# EasyEDA Pro project ProPrj_飞行器设计之5.8Ghz图传_2025-12-20.epro, board PCB1_1
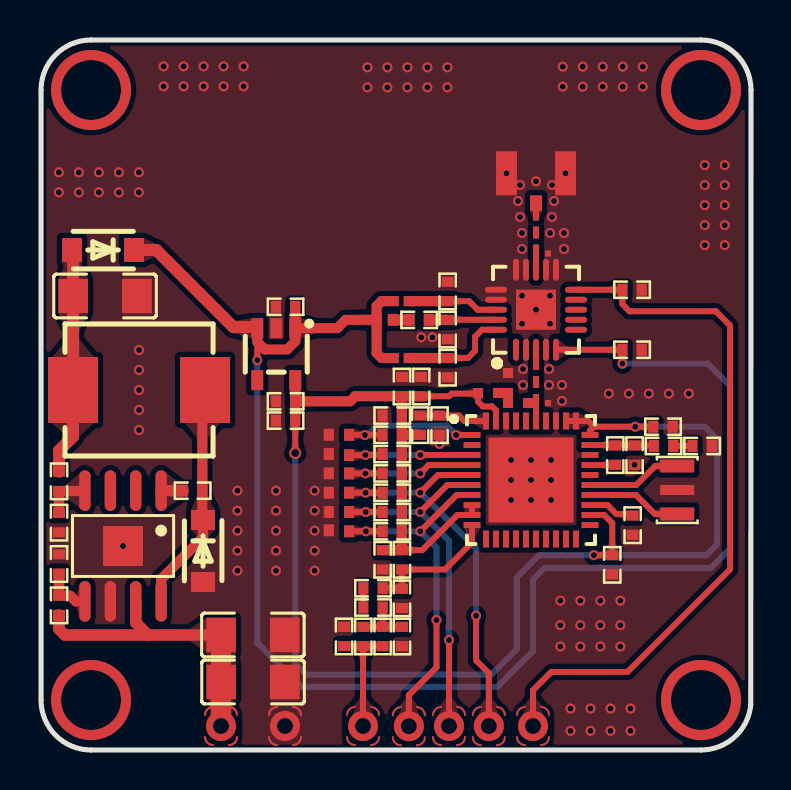
[diagram p13: board, top side]
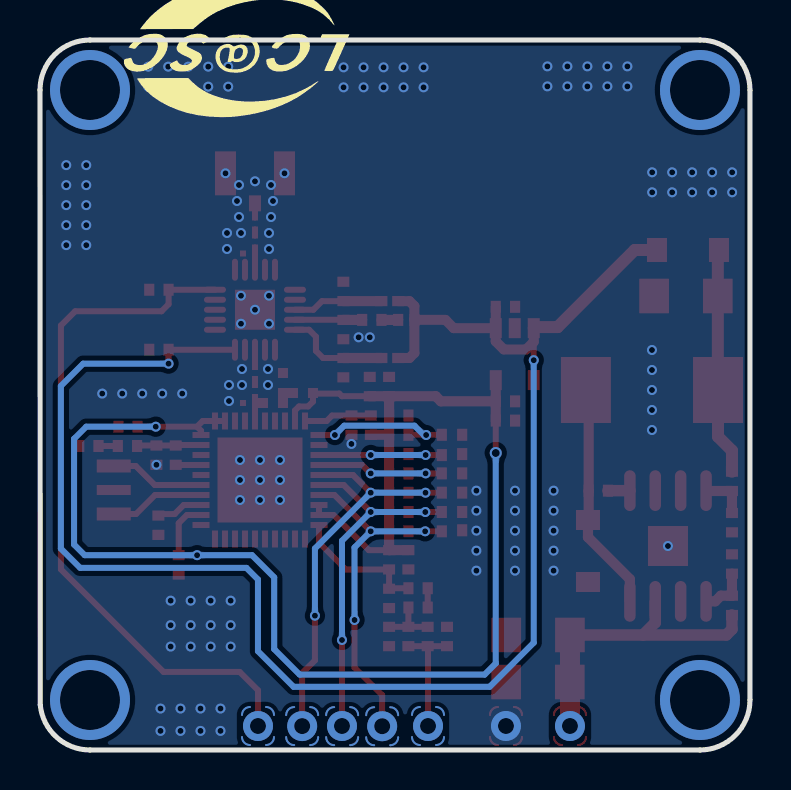
[diagram p14: board, bottom side, seen from below]

Outline 35.5 x 35.5 mm; copper layers: Top Layer, Inner1, Inner2, Bottom Layer. Coordinates in mm from the lower left corner of the outline.
Outline path: 0,33 arc(0.73,34.77) 2.5,35.5 33,35.5 arc(34.77,34.77) 35.5,33 35.49,2.25 arc(34.68,0.65) 33,0 2.5,0 arc(0.73,0.73) 0,2.5 0,33
Stack: Top Layer 0.035mm / Dielectric1 0.48mm PP er 4.5 / Inner1 0.035mm / Dielectric2 0.48mm FR4 er 4.5 / Inner2 0.035mm / Dielectric3 0.48mm PP er 4.5 / Bottom Layer 0.035mm

## Design rules (mm)
spacing safeClearance (default): track to track 0.152, other pairs 0.152 to 0.3
spacing Plane_innerPlane: track to track 0.152, other pairs 0.152 to 0.3
spacing Copper_copperRegion: track to track 0.152, other pairs 0.152 to 0.3
track width trackWidth (default): min 0.127, default 0.254, max 2.54
differential pair differentialPair (default): width min 0.127, default 0.254, max 2.54; gap min 0.152, default 0.152
pour e422 uses Copper_copperRegion
pour e430 uses Copper_copperRegion
pour e432 uses Copper_copperRegion
pour e435 uses Copper_copperRegion

## Placement (name value [footprint] x y rotation side)
C1  2.2uF  [C0402]  20.33 21.02 270 top
C2  2.2uF  [C0402]  20.33 19.12 90 top
C3  2.2uF  [C0402]  20.33 22.93 90 top
C4  1uF  [C0402]  19.01 18.17 270 top
C5  20pF  [C0402-0.5]  23.35 18.35 270 top
C6  10pF  [C0201]  24.75 18.85 90 top
C7  10pF  [C0201]  24.75 26.33 90 top
C8  1nF  [C0402]  29.55 20.01 0 top
C9  10pF  [C0402]  29.55 23.01 180 top
C10  1uF  [C0402]  18.05 18.17 270 top
C11  1uF  [C0402]  17.56 16.72 0 top
C12  103  [C0402]  7.58 12.97 180 top
C13  220uF  [C1206]  3.2 22.7 180 top
C14  22uF  [C1206]  10.59 5.75 0 top
C15  22uF  [C1206]  10.6 3.4 0 top
C16  1nF  [C0402]  19.92 16.24 270 top
C17  4.7uF  [C0402]  31.1 16.17 180 top
C18  4.7uF  [C0402]  33.06 15.2 180 top
C19  1uF  [C0402]  29.68 14.74 90 top
C20  1uF  [C0402]  12.23 22.16 0 top
C21  104  [C0402]  12.23 16.47 0 top
C22  10uF  [C0402]  12.23 17.44 0 top
C23  1uF  [C0402]  17.08 9.51 270 top
C24  470nF  [C0402]  29.58 11.24 270 top
C25  4.7uF  [C0402]  16.6 7.12 0 top
C26  1uF  [C0402]  28.56 9.26 270 top
C27  56pF  [C0402]  16.11 5.68 90 top
C28  1.7pF  [C0201]  24.75 17.95 90 top
C29  1.7pF  [C0201]  24.75 25.43 90 top
D1  SS14L  [SOD-123F_L2.8-W1.8-LS3.7-RD]  3.1 25 180 top
D2  SS14L  [SOD-123F_L2.8-W1.8-LS3.7-RD]  8.1 9.95 270 top
L1  6.8nH  [L0402]  23.85 17.35 0 top
L2  15uH  [IND-SMD_L7.4-W6.6]  4.9 18 0 top
L3  2.4nH  [L0201]  25.05 17.35 180 top
L4  2.2nH  [L0201]  25.05 24.83 180 top
LDO1  XC6204B332MR  [SOT-23-5_L3.0-W1.7-P0.95-LS2.8-BR]  11.76 19.79 90 top
R1  10ohm  [R0402-0.5]  22.35 17.85 180 top
R2  10k  [R0402]  0.9 13.43 90 top
R3  51ohm  [R0402]  18.96 16.24 270 top
R4  40.2K  [R0402]  0.9 7.23 270 top
R5  3.24kΩ  [R0402]  0.9 11.37 90 top
R6  20K  [R0402]  0.9 9.3 90 top
R7  1k  [R0402]  17.56 15.76 0 top
R8  47k  [R0402]  31.13 15.2 0 top
R9  1k  [R0402]  17.56 14.79 0 top
R10  1k  [R0402]  17.56 13.83 0 top
R11  100k  [R0402]  28.71 14.74 90 top
R12  1k  [R0402]  17.56 12.86 0 top
R13  1k  [R0402]  17.56 11.9 0 top
R14  1k  [R0402]  17.56 10.93 0 top
R15  510k  [R0402]  18.05 9.51 90 top
R16  200ohm  [R0402]  18.05 5.68 90 top
R17  3.3k  [R0402]  16.6 8.09 0 top
R18  560K  [R0402]  18.05 7.58 90 top
R19  1.2k  [R0402]  17.08 5.68 90 top
R20  82ohm  [R0402]  15.15 5.68 270 top
R21  0ohm  [R0402]  18.91 21.51 180 top
RF1  BWIPX-1-001E  [IPEX-SMD_BWIPX-1-001E]  24.75 29.58 270 top
T1  -  [TEST_PAD]  24.6 1.2 270 bottom
T2  -  [TEST_PAD]  24.6 1.2 90 top
T3  -  [TEST_PAD]  9 1.2 270 top
T4  -  [TEST_PAD]  9 1.2 90 top
T5  -  [TEST_PAD]  12.2 1.2 270 top
T6  -  [TEST_PAD]  12.2 1.2 90 top
T7  -  [TEST_PAD]  16.1 1.2 90 top
T8  -  [TEST_PAD]  16.1 1.2 270 bottom
T9  -  [TEST_PAD]  22.39 1.19 90 top
T10  -  [TEST_PAD]  22.39 1.2 270 bottom
T11  -  [TEST_PAD]  20.4 1.2 90 top
T12  -  [TEST_PAD]  20.39 1.19 270 bottom
T13  -  [TEST_PAD]  18.39 1.19 90 top
T14  -  [TEST_PAD]  18.39 1.19 270 bottom
TEST1  -  [Test]  17.59 19.67 90 top
TEST2  -  [Test#3]  17.03 21.59 180 top
TEST3  -  [Test#2]  18.15 23.23 90 top
TEST4  -  [Test#4]  17.57 21.69 180 top
TEST5  -  [Test#7]  19.06 19.67 90 top
TEST6  -  [Test#6]  18.25 26.07 90 top
TEST7  -  [Test#5]  15.41 15.76 0 top
TEST8  -  [Test#5]  14.39 15.76 0 top
TEST9  -  [Test#5]  14.39 14.8 0 top
TEST10  -  [Test#5]  15.41 14.74 0 top
TEST11  -  [Test#5]  14.39 13.83 0 top
TEST12  -  [Test#5]  14.39 12.87 0 top
TEST13  -  [Test#5]  14.39 11.9 0 top
TEST14  -  [Test#5]  15.41 13.83 0 top
TEST15  -  [Test#5]  14.39 10.99 0 top
TEST16  -  [Test#5]  15.41 12.87 0 top
TEST17  -  [Test#5]  15.41 11.9 0 top
TEST18  -  [Test#5]  15.41 10.93 0 top
U1  RFPA5542TR13  [QFN-20_L4.0-W4.0]  24.75 22.01 0 top
U2  TPS5430DDAR  [SOIC-8_L5.0-W4.0-P1.27-LS6.0-BL-EP2.0]  4.1 10.2 180 top
U3  -  [QFN-40-1]  24.5 13.5 0 top
X1  8MHz  [OSC-SMD_3P-L3.2-W1.3-P1.2-L]  31.81 13 270 top

## Footprints (pads in the part's own frame, mm; a bottom-side part is the same pattern mirrored in y, then rotated)
C0201
  rect 0.3x0.3 smd: 1(-0.3,0) 2(0.3,0)
C0402
  rect 0.508x0.6 smd: 1(-0.483,0) 2(0.483,0)
C0402-0.5
  rect 0.5x0.5 smd: 1(-0.5,0) 2(0.5,0)
C1206
  rect 1.485x1.728 smd: 1(-1.593,0) 2(1.593,0)
IND-SMD_L7.4-W6.6
  rect 2.499x3.3 smd: 1(-3.302,0) 2(3.302,0)
IPEX-SMD_BWIPX-1-001E
  rect 0.8x0.6 smd: 1(2.243,0)
  rect 2.2x1.05 smd: 2(0.743,1.475) 3(0.743,-1.475)
L0201
  rect 0.3x0.3 smd: 1(-0.3,0) 2(0.3,0)
L0402
  rect 0.5x0.5 smd: 1(-0.5,0) 2(0.5,0)
OSC-SMD_3P-L3.2-W1.3-P1.2-L
  rect 0.65x1.7 smd: 1(-1.199,0) 3(1.199,0)
  rect 0.5x1.7 smd: 2(0,0)
QFN-20_L4.0-W4.0
  oval 0.3x1.1 smd: 1(-1,-2) 2(-0.5,-2) 3(0,-2) 4(0.5,-2) 5(1,-2) 11(1,2) 12(0.5,2) 13(0,2) 14(-0.5,2) 15(-1,2)
  oval 1.1x0.3 smd: 6(2,-1) 7(2,-0.5) 8(2,0) 9(2,0.5) 10(2,1) 16(-2,1) 17(-2,0.5) 18(-2,0) 19(-2,-0.5) 20(-2,-1)
  rect 2x2 smd: 21(0,0)
QFN-40-1
  rect 0.85x0.3 smd: 1(-2.95,2.25) 2(-2.95,1.75) 3(-2.95,1.25) 4(-2.95,0.75) 5(-2.95,0.25) 6(-2.95,-0.25) 7(-2.95,-0.75) 8(-2.95,-1.25) 9(-2.95,-1.75) 10(-2.95,-2.25) 21(2.95,-2.25) 22(2.95,-1.75) 23(2.95,-1.25) 24(2.95,-0.75) 25(2.95,-0.25) 26(2.95,0.25) 27(2.95,0.75) 28(2.95,1.25) 29(2.95,1.75) 30(2.95,2.25)
  rect 0.3x0.85 smd: 11(-2.25,-2.95) 12(-1.75,-2.95) 13(-1.25,-2.95) 14(-0.75,-2.95) 15(-0.25,-2.95) 16(0.25,-2.95) 17(0.75,-2.95) 18(1.25,-2.95) 19(1.75,-2.95) 20(2.25,-2.95) 31(2.25,2.95) 32(1.75,2.95) 33(1.25,2.95) 34(0.75,2.95) 35(0.25,2.95) 36(-0.25,2.95) 37(-0.75,2.95) 38(-1.25,2.95) 39(-1.75,2.95) 40(-2.25,2.95)
  rect 4.25x4.25 smd: 41(0,0)
R0402
  rect 0.508x0.6 smd: 1(-0.483,0) 2(0.483,0)
R0402-0.5
  rect 0.5x0.5 smd: 1(-0.5,0) 2(0.5,0)
SOD-123F_L2.8-W1.8-LS3.7-RD
  rect 1x1.2 smd: 1(-1.55,0) 2(1.55,0)
SOIC-8_L5.0-W4.0-P1.27-LS6.0-BL-EP2.0
  oval 0.574x2.037 smd: 1(-1.905,-2.768) 2(-0.635,-2.768) 3(0.635,-2.768) 4(1.905,-2.768) 5(1.905,2.768) 6(0.635,2.768) 7(-0.635,2.768) 8(-1.905,2.768)
  rect 1.999x1.999 smd: 9(0,0)
SOT-23-5_L3.0-W1.7-P0.95-LS2.8-BR
  rect 1x0.6 smd: 1(1.3,-0.95) 2(1.3,0) 3(1.3,0.95) 4(-1.3,0.95) 5(-1.3,-0.95)
Test
  rect 0.508x0.6 smd: 1(-0.072,0)
Test#2
  rect 0.508x0.6 smd: 1(-0.784,0.559)
Test#3
  rect 0.508x0.6 smd: 1(0.247,0.08)
Test#4
  rect 0.508x0.6 smd: 1(-0.025,0.182)
Test#5
  rect 0.508x0.6 smd: 1(0,0)
Test#6
  rect 0.508x0.6 smd: 1(-3.628,-0.177)
Test#7
  rect 0.508x0.6 smd: 1(-0.072,0.635)
TEST_PAD
  custom 1.9x1.6 smd: 1(0,0)

## Nets
As in the schematic, except:
+3.3V: C4.2 C10.2 C11.2 C17.2 C21.2 C22.2 C23.1 C26.1 LDO1.5 R1.2 R3.2 R7.2 R9.2 R10.2 R12.2 R13.2 R14.2 R15.2 U3.8 U3.9 U3.22 U3.30 U3.31 U3.32 U3.39
GND: C1.2 C2.1 C3.2 C4.1 C5.1 C8.2 C9.1 C10.1 C11.1 C13.1 C14.2 C15.2 C16.2 C17.1 C18.1 C19.1 C20.1 C21.1 C22.1 C23.2 C24.2 C26.2 D2.2 L3.1 L4.1 LDO1.2 R5.1 R6.2 R16.1 R18.1 R20.1 RF1.2 RF1.3 T5.1 T6.1 TEST8.1 TEST9.1 TEST11.1 TEST12.1 TEST13.1 TEST15.1 U1.2 U1.4 U1.11 U1.12 U1.14 U1.15 U1.16 U1.17 U1.21 U2.6 U2.9 U3.28 U3.33 U3.38 U3.41 X1.2

Pads without a net: LDO1 4; U1 1 6 7 8 9; U2 2 3; U3 2 11 12 13 14 15 16 17 18 19 20 21 26 34 36 37

## Via types
v1: diameter 4, hole 3, Top Layer to Bottom Layer, 4 vias
v2: diameter 0.5, hole 0.3, Top Layer to Bottom Layer, 153 vias
v3: diameter 1.5, hole 0.8, Top Layer to Bottom Layer, 7 vias
v4: diameter 0.6, hole 0.4, Top Layer to Bottom Layer, 1 via

## Routing (per net, layer and track width the routed paths; a pad name or vN(x,y) marks a point on that pad's centre or on a via; arc(x,y) is an arc through that point)
+3.3V: length 84.3
  Top Layer w0.3: U3.32 U3.31 27.36,16.45 27.65,16.17 ; U3.39 22.75,16.98 22.55,17.18 22.09,17.18 21.85,17.42 R1.2 ; C4.2 20.4,17.69 20.53,17.82 21.82,17.82 ; R15.2 19.06,9.99 20.82,11.75 U3.9 U3.8 ; 27.65,16.17 v2(29.71,16.17) C17.2 ; 27.65,16.17 27.45,15.96 27.45,15.75 U3.30 ; C21.2 v4(12.71,14.85) 12.71,14.85 ; v2(27.65,9.74) 28.56,9.74 28.56,11.34 28.16,11.75 U3.22
  Top Layer w0.508: C10.2 15.71,17.69 15.46,17.44 C22.2 ; C10.2 C11.2 R7.2 ; C10.2 C4.2 ; C22.2 C21.2 ; C22.2 12.71,18.49 ; R7.2 R3.2 ; R7.2 R9.2 R10.2 R12.2 R13.2 R14.2 R15.2 C23.1
  Bottom Layer w0.3: v4(12.71,14.85) 12.71,4.33 13.27,3.77 22.52,3.77 23.79,5.04 23.79,8.63 24.9,9.74 v2(27.65,9.74) 33.26,9.74 33.8,10.27 33.8,15.56 33.19,16.17 v2(29.71,16.17)
+4V5: length 83.5
  Top Layer w0.3: 10.81,20.41 v2(10.81,19.49) ; v2(29.07,19.32) 29.07,20.09 29,20.01 U1.5
  Top Layer w0.5: 17.59,22.44 17.03,22.44 16.78,22.19 TEST2.1 ; 17.59,19.6 17.03,19.6 16.78,19.85 TEST2.1 ; TEST2.1 15.23,21.51 14.81,21.09 12.71,21.09 ; C20.2 12.71,21.09 ; 12.71,21.09 12.71,21.09 12.71,20.43 12.31,20.03 11.19,20.03 10.81,20.41 LDO1.3
  Top Layer w0.6: LDO1.3 10.76,21.15 9.62,21.15 5.76,25 D1.1
  Bottom Layer w0.3: v2(29.07,19.32) 33.34,19.32 34.46,18.2 34.46,10.07 33.49,9.11 25.18,9.11 24.6,8.53 24.6,4.94 22.82,3.16 13.02,3.16 10.81,5.37 v2(10.81,19.49)
+5V: length 11.4
  Top Layer w0.6: R2.2 0.9,14.97 1.6,15.67 L2.1 1.61,18.01 C13.2 1.61,24.94 D1.2
GND: length 0.5
  Top Layer w0.3: v2(19.93,15.3) 19.92,15.31 C16.2
  vias: v2(0.89,28.88) v2(0.89,27.88) v2(1.89,28.88) v2(1.89,27.88) v2(2.89,28.88) v2(2.89,27.88) v2(3.89,28.88) v2(3.89,27.88) v2(4.1,10.2) v2(4.89,28.88) v2(4.89,27.88) v2(4.9,20) v2(4.9,19) v2(4.9,18) v2(4.9,17) v2(4.9,16) v2(6.13,34.18) v2(6.13,33.18) v2(7.13,34.18) v2(7.13,33.18) v2(8.13,34.18) v2(8.13,33.18) v2(9.13,34.18) v2(9.13,33.18) v2(9.82,12.97) v2(9.82,11.97) v2(9.82,10.97) v2(9.82,9.97) v2(9.82,8.97) v2(10.13,34.18) v2(10.13,33.18) v2(11.75,12.97) v2(11.75,11.97) v2(11.75,10.97) v2(11.75,9.97) v2(11.75,8.97) v2(13.68,12.97) v2(13.68,11.97) v2(13.68,10.97) v2(13.68,9.97) v2(13.68,8.97) v2(16.32,34.13) v2(16.32,33.13) v2(17.32,34.13) v2(17.32,33.13) v2(18.32,34.13) v2(18.32,33.13) v2(19.01,20.64) v2(19.32,34.13) v2(19.32,33.13) v2(19.57,20.64) v2(20.32,34.13) v2(20.32,33.13) v2(23.28,28.84) v2(23.5,14.5) v2(23.5,13.5) v2(23.5,12.5) v2(23.85,27.45) v2(23.95,28.25) v2(23.95,26.65) v2(24.05,25.85) v2(24.05,25.05) v2(24.05,22.71) v2(24.05,21.31) v2(24.1,19.05) v2(24.1,18.25) v2(24.5,14.5) v2(24.5,13.5) v2(24.5,12.5) v2(24.75,28.44) v2(24.75,22.01) v2(25.4,19.05) v2(25.4,18.25) v2(25.45,25.85) v2(25.45,22.71) v2(25.45,21.31) v2(25.5,14.5) v2(25.5,13.5) v2(25.5,12.5) v2(25.55,28.25) v2(25.65,27.45) v2(25.55,26.65) v2(25.97,7.47) v2(25.97,6.24) v2(25.97,5.17) v2(26.09,34.17) v2(26.09,33.17) v2(26.05,18.25) v2(26.05,17.45) v2(26.22,28.84) v2(26.15,25.85) v2(26.15,25.05) v2(26.47,2.07) v2(26.47,0.96) v2(26.97,7.47) v2(26.97,6.24) v2(26.97,5.17) v2(27.09,34.17) v2(27.09,33.17) v2(27.47,2.07) v2(27.47,0.96) v2(27.97,7.47) v2(27.97,6.24) v2(27.97,5.17) v2(28.09,34.17) v2(28.09,33.17) v2(28.39,17.82) v2(28.47,2.07) v2(28.47,0.96) v2(28.97,7.47) v2(28.97,6.24) v2(28.97,5.17) v2(29.09,34.17) v2(29.09,33.17) v2(29.39,17.82) v2(29.47,2.07) v2(29.47,0.96) v2(29.68,14.26) v2(30.09,34.17) v2(30.09,33.17) v2(30.39,17.82) v2(31.39,17.82) v2(32.39,17.82) v2(33.19,29.24) v2(33.19,28.24) v2(33.19,27.24) v2(33.19,26.24) v2(33.19,25.24) v2(34.19,29.24) v2(34.19,28.24) v2(34.19,27.24) v2(34.19,26.24) v2(34.19,25.24) v3(12.2,1.2)
VCC: length 15.4
  Top Layer w0.574: C14.1 5.35,5.75 ; 5.35,5.75 1.18,5.75 0.9,6.04 R4.2 ; 5.35,5.75 4.74,6.37 4.74,7.43
  Top Layer w1: v3(9,1.2) 9,5.75 C14.1
(no net):
  vias: v1(2.5,33) v1(2.5,2.5) v1(33,33) v1(33,2.5)
CS0: length 20.5
  Top Layer w0.3: TEST16.1 v2(16.22,12.87) 17.08,12.86 ; v2(18.96,12.87) 19.85,13.75 U3.5 ; T9.1 v3(22.39,1.2) 22.39,3.84 21.75,4.48 v2(21.75,6.72)
  Bottom Layer w0.3: v2(16.22,12.87) v2(18.96,12.87) 21.75,10.07 v2(21.75,6.72)
CS1: length 18.8
  Top Layer w0.3: v2(18.96,11.9) 20.31,13.25 U3.6 ; 17.08,11.9 v2(16.23,11.9) TEST17.1 ; v3(20.4,1.2) v2(20.4,5.5)
  Bottom Layer w0.3: v2(20.4,5.5) 20.4,10.46 v2(18.96,11.9) ; 18.96,11.9 v2(16.23,11.9)
CS2: length 18.4
  Top Layer w0.3: TEST18.1 v2(16.24,10.93) 17.08,10.93 R14.1 ; U3.7 20.78,12.75 v2(18.96,10.93) ; v3(18.39,1.19) 18.39,2.75 19.77,4.13 v2(19.77,6.5)
  Bottom Layer w0.3: v2(16.24,10.93) v2(18.96,10.93) 19.77,10.13 v2(19.77,6.5)
VIDEO: length 5.9
  Top Layer w0.3: v3(16.1,1.2) 16.1,5.18 C27.1 ; C27.1 R19.1 ; C27.1 R20.2
$1N985: length 1.1
  Top Layer w0.574: C12.2 6.01,12.97 U2.1
$1N1270: length 11.5
  Top Layer w0.508: U2.8 6,8.54 8.1,10.64 D2.1 8.07,11.53 C12.1 8.07,17.86 L2.2
$1N2973: length 2.5
  Top Layer w0.508: R6.1 R4.1 1.46,7.72 1.74,7.43 U2.5
$1N29749: length 7
  Top Layer w0.3: TEST10.1 16.21,14.74 v2(16.22,14.75) 17.03,14.75 R9.1 ; v2(18.96,14.75) U3.3
  Bottom Layer w0.3: v2(16.22,14.75) v2(18.96,14.75)
$1N29784: length 7.2
  Top Layer w0.3: TEST14.1 v2(16.22,13.83) 16.22,13.83 R10.1 ; U3.4 19.38,14.25 v2(18.96,13.83)
  Bottom Layer w0.3: v2(18.96,13.83) 16.22,13.83
$1N30691: length 7.4
  Top Layer w0.3: R7.1 16.2,15.76 v2(16.19,15.75) 16.18,15.76 TEST7.1 ; U3.1 v2(20.75,15.75)
  Bottom Layer w0.3: v2(16.19,15.75) 16.31,15.75 16.78,16.22 20.29,16.22 v2(20.75,15.75)
$1N35430: length 6.9
  Top Layer w0.3: 18.02,8.09 18.05,8.11 R15.1 20.21,9.03 21.55,10.37 U3.10 ; 18.02,8.09 R17.2 ; 18.02,8.09 R18.2
$1N35502: length 1
  Top Layer w0.3: C25.1 R17.1
$1N37428: length 2.9
  Top Layer w0.3: R16.2 R19.2 ; R19.2 C27.2 ; R19.2 C25.2
$1N43323: length 1.3
  Top Layer w0.3: R11.1 28.7,14.25 U3.27
$1N43978: length 1
  Top Layer w0.3: R8.2 C18.2
$1N44248: length 3.2
  Top Layer w0.3: U3.29 28.69,15.25 R11.2 C19.2 30.62,15.23 R8.1
$1N44995: length 4.8
  Top Layer w0.3: X1.1 30.71,14.2 29.76,13.25 U3.25
$1N45085: length 4.8
  Top Layer w0.3: X1.3 30.69,11.8 29.75,12.75 U3.24
$1N52247: length 3.4
  Top Layer w0.3: R3.1 C16.1 20.89,16.73 21.17,16.45 U3.40
$1N57648: length 1
  Top Layer w0.5: R1.1 C5.2 L1.1
$1N59286: length 0.9
  Top Layer w0.3: C6.2 U1.3
$1N64215: length 2.3
  Top Layer w0.3: C24.1 29.5,11.8 28.77,11.8 28.32,12.25 U3.23
$1N65846: length 35.2
  Top Layer w0.3: v3(24.6,1.2) 24.6,1.2 24.6,2.99 25.51,3.9 29.32,3.9 34.45,9.03 34.45,21.23 33.74,21.94 29.42,21.94 29.07,22.29 C9.2 U1.10
$1N103981: length 0.7
  Top Layer w0.3: RF1.1 C7.2
$1N115820: length 5.3
  Top Layer w0.3: C2.2 21.35,19.6 21.7,19.96 21.7,20.67 22.05,21.01 U1.20
  Top Layer w0.508: TEST5.1 C2.2
$1N117066: length 4.5
  Top Layer w0.3: C3.1 21.4,22.44 21.83,22.01 U1.18
  Top Layer w0.508: TEST6.1 C3.1
$1N131298: length 2.4
  Top Layer w0.508: R5.2 R2.1 2.18,12.95 U2.4
$1N139673: length 0.8
  Top Layer w0.508: R21.2 TEST4.1
$1N140523: length 3.4
  Top Layer w0.3: U1.19 20.34,21.51 C1.1
  Top Layer w0.508: C1.1 R21.1
$1N148789: length 0.3
  Top Layer w0.3: C29.2 C7.1
$1N149074: length 1.1
  Top Layer w0.3: 24.75,25.12 U1.13
$1N149538: length 0.3
  Top Layer w0.3: C28.2 C6.1
$1N149835: length 1.5
  Top Layer w0.3: C28.1 L3.2 U3.35
  Top Layer w0.5: L1.2 24.65,17.35

## Copper pours and planes (outline as drawn; the poured copper is in the pictures)
+4V5 on Inner2: 0.27,2.5 0.92,0.91 2.51,0.26 33,0.26 34.55,0.9 35.19,2.45 35.19,33 34.55,34.57 32.98,35.22 2.5,35.22 0.92,34.56 0.27,32.98
GND on Top Layer: 0.27,32.98 0.92,34.56 2.5,35.22 32.98,35.22 34.55,34.57 35.19,33 35.19,2.45 34.55,0.9 33,0.26 2.51,0.26 0.92,0.91 0.27,2.5
GND on Bottom Layer: 0.27,32.98 0.92,34.56 2.5,35.22 32.98,35.22 34.55,34.57 35.19,33 35.19,2.45 34.55,0.9 33,0.26 2.51,0.26 0.92,0.91 0.27,2.5
GND on Inner1: 0.27,32.98 0.92,34.56 2.5,35.22 32.98,35.22 34.55,34.57 35.19,33 35.19,2.45 34.55,0.9 33,0.26 2.51,0.26 0.92,0.91 0.27,2.5

Small or netless copper shapes (teardrops, artwork), in the pictures only: 216 on Top Layer, 24 on Bottom Layer
